# EAGLE design at90USB (EAGLE 5.03)
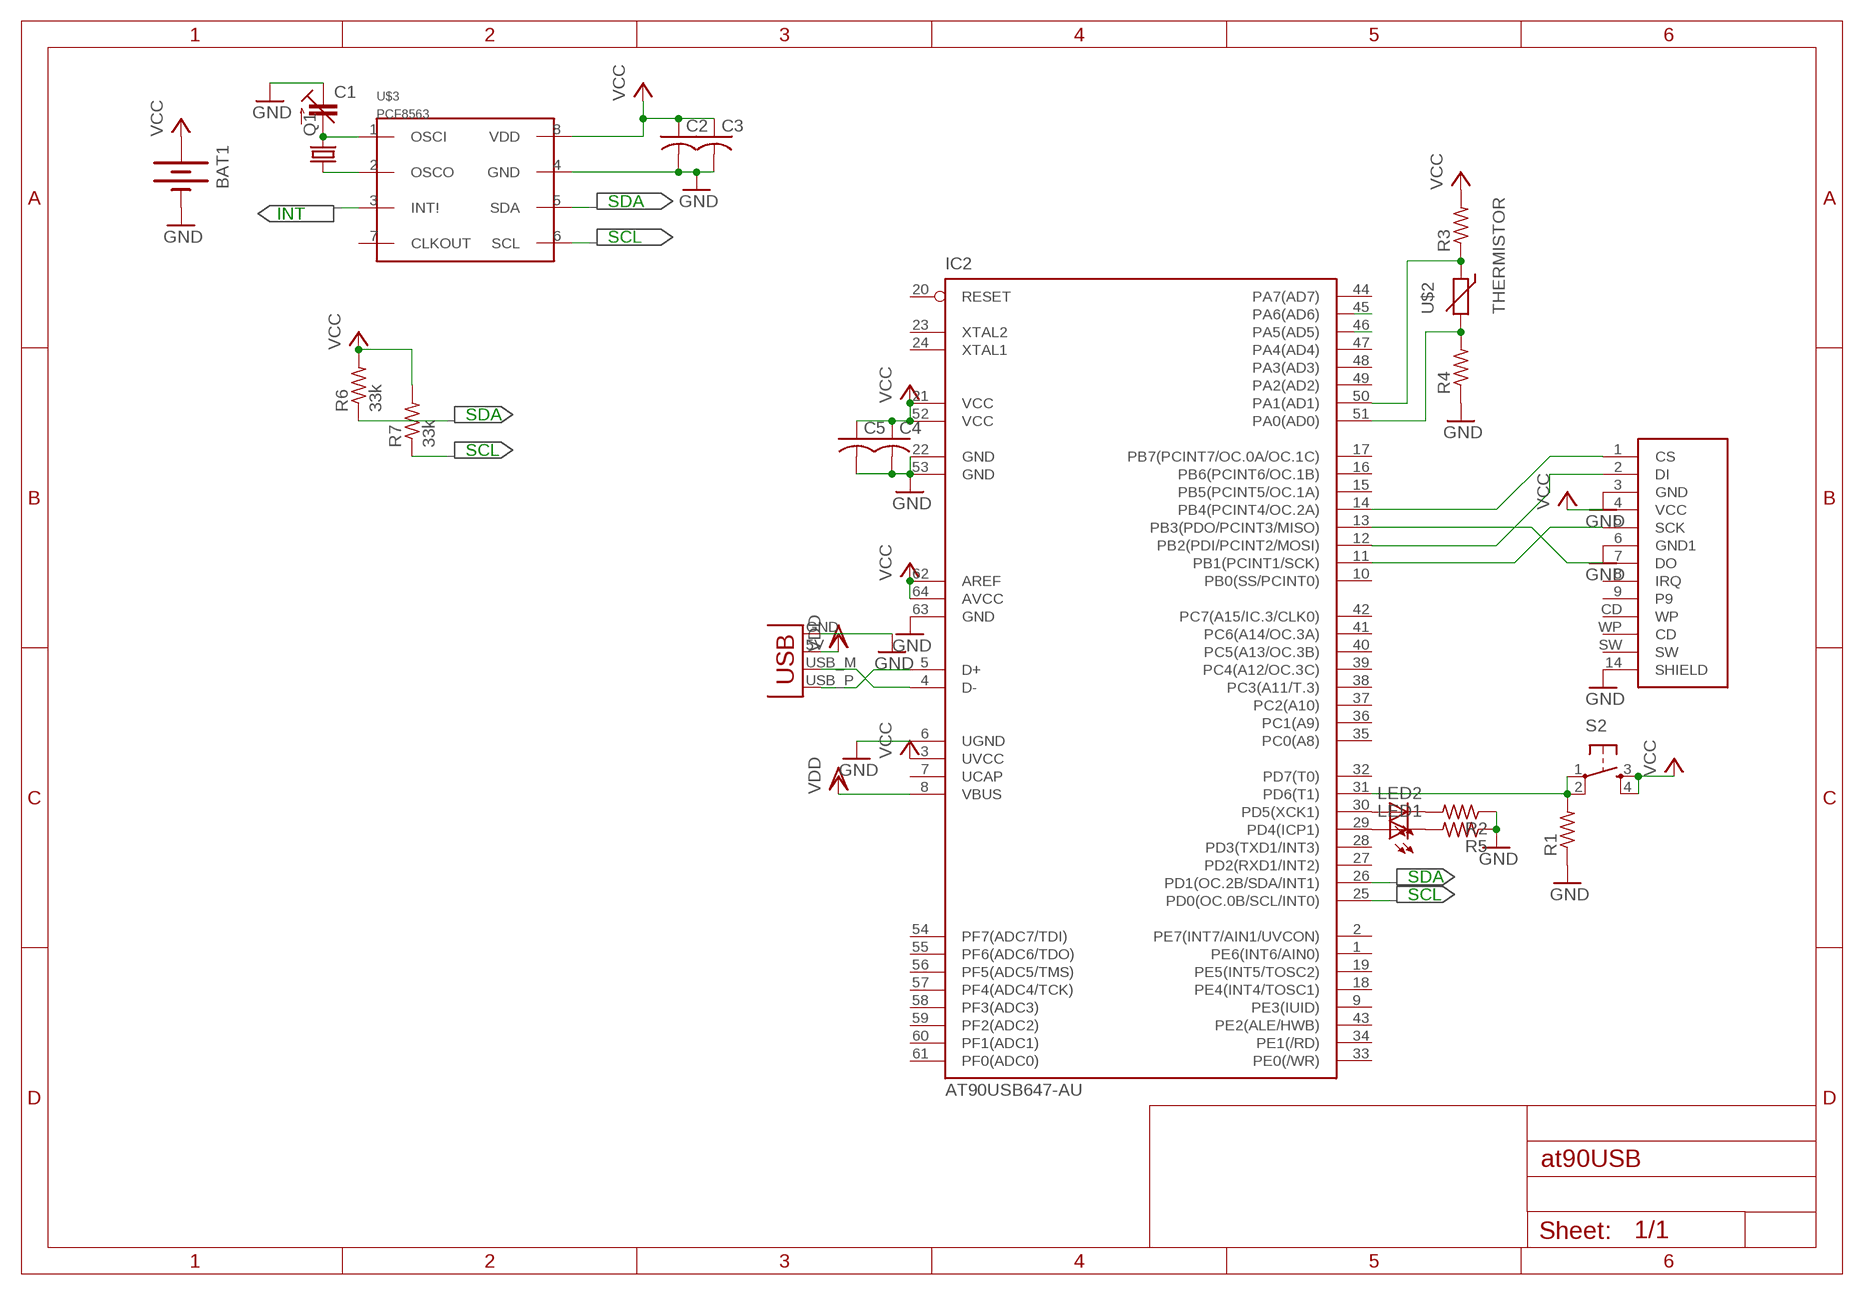
[diagram p0: schematic, sheet 1]

## Parts
BAT1  BATTERY20SMD  [BATTCON_20MM]
C1  C-TRIMM3018_11  [CTRIM3018_11]
C2  C-USC0603  [C0603]
C3  C-USC0603  [C0603]
C4  C-USC0603  [C0603]
C5  C-USC0603  [C0603]
IC2  AT90USB647-AU  [TQFP64]
LED1  LEDCHIP-LED0603  [CHIP-LED0603]
LED2  LEDCHIP-LED0603  [CHIP-LED0603]
Q1  CRYSTAL5X3  [CRYSTAL-SMD-5X3]
R1  R-US_R0603  [R0603]
R2  R-US_R0603  [R0603]
R3  R-US_R0603  [R0603]
R4  R-US_R0603  [R0603]
R5  R-US_R0603  [R0603]
R6  33k  R-US_R0603  [R0603]
R7  33k  R-US_R0603  [R0603]
S2  TAC_SWITCHSMD  [TACTILE_SWITCH_SMD]
U$1  SD_CARD_SOCKETSD  [SD-MMC_SOCKET-PP]
U$2  THERMISTOR  [0603]
U$3  PCF8563  [SO8]
X1  USBPCB  [USB-A-PCB]

## Nets
GND: BAT1.2(-) C1.+(E) C2.2 C3.2 C4.2 C5.2 IC2.6(UGND) IC2.22(GND) IC2.53(GND) IC2.63(GND) R1.1 R2.1 R4.1 R5.1 U$1.3(GND) U$1.6(GND1) U$1.14(SHIELD) U$3.4(GND) X1.GND
N$1: IC2.45(PA6(AD6))
N$2: U$3.3(INT!)
N$3: IC2.51(PA0(AD0)) R4.2 U$2.2
N$4: IC2.5(D+) X1.USB_P(D+)
N$5: IC2.4(D-) X1.USB_M(D-)
N$6: IC2.29(PD4(ICP1)) LED1.A
N$7: IC2.11(PB1(PCINT1/SCK)) U$1.5(SCK)
N$8: IC2.12(PB2(PDI/PCINT2/MOSI)) U$1.2(DI)
N$9: IC2.13(PB3(PDO/PCINT3/MISO)) U$1.7(DO)
N$10: IC2.14(PB4(PCINT4/OC.2A)) U$1.1(CS)
N$11: IC2.30(PD5(XCK1)) LED2.A
N$12: IC2.31(PD6(T1)) R1.2 S2.1 S2.2
N$13: IC2.50(PA1(AD1)) R3.1 U$2.1
N$14: IC2.46(PA5(AD5))
N$15: LED2.C R2.2
N$16: LED1.C R5.2
N$17: C1.-(A) Q1.3 U$3.1(OSCI)
N$18: Q1.1 U$3.2(OSCO)
SCL: IC2.25(PD0(OC.0B/SCL/INT0)) R7.1 U$3.6(SCL)
SDA: IC2.26(PD1(OC.2B/SDA/INT1)) R6.1 U$3.5(SDA)
VCC: BAT1.1(+) C2.1 C3.1 C4.1 C5.1 IC2.3(UVCC) IC2.21(VCC) IC2.52(VCC) IC2.62(AREF) IC2.64(AVCC) R3.2 R6.2 R7.2 S2.3 S2.4 U$1.4(VCC) U$3.8(VDD)
VDD: IC2.8(VBUS) X1.5V(VBUS)
Unconnected: IC2.1(PE6(INT6/AIN0)) IC2.2(PE7(INT7/AIN1/UVCON)) IC2.9(PE3(IUID)) IC2.10(PB0(SS/PCINT0)) IC2.15(PB5(PCINT5/OC.1A)) IC2.16(PB6(PCINT6/OC.1B)) IC2.17(PB7(PCINT7/OC.0A/OC.1C)) IC2.18(PE4(INT4/TOSC1)) IC2.19(PE5(INT5/TOSC2)) IC2.20(RESET) IC2.23(XTAL2) IC2.24(XTAL1) IC2.27(PD2(RXD1/INT2)) IC2.28(PD3(TXD1/INT3)) IC2.32(PD7(T0)) IC2.33(PE0(/WR)) IC2.34(PE1(/RD)) IC2.35(PC0(A8)) IC2.36(PC1(A9)) IC2.37(PC2(A10)) IC2.38(PC3(A11/T.3)) IC2.39(PC4(A12/OC.3C)) IC2.40(PC5(A13/OC.3B)) IC2.41(PC6(A14/OC.3A)) IC2.42(PC7(A15/IC.3/CLK0)) IC2.43(PE2(ALE/HWB)) IC2.44(PA7(AD7)) IC2.47(PA4(AD4)) IC2.48(PA3(AD3)) IC2.49(PA2(AD2)) IC2.54(PF7(ADC7/TDI)) IC2.55(PF6(ADC6/TDO)) IC2.56(PF5(ADC5/TMS)) IC2.57(PF4(ADC4/TCK)) IC2.58(PF3(ADC3)) IC2.59(PF2(ADC2)) IC2.60(PF1(ADC1)) IC2.61(PF0(ADC0)) U$1.8(IRQ) U$1.9 U$1.CD(WP) U$1.SW U$1.WP(CD) U$3.7(CLKOUT)

## Notes on the sheet
- INT | SDA
- SCL
- SDA
- SCL
- SDA
- SCL

## Power pins joined to a net without a drawn wire
UCAP: IC2.7(UCAP)

## Library data of the parts
BAT1 = SparkFun:BATTERY: Battery Holders Various common sizes : AA, AAA, 20mm coin cell and 12mm coin cell.
C1 = rcl:C-TRIMM: Trimm capacitor
C2-C5 = rcl:C-US: CAPACITOR, American symbol
IC2 = at90usb:AT90USB647-*: Atmel AT90USB647 AVR Microcontroller with USB Interface and 64kB Flash Memory
LED1 LED2 = led:LED: LED OSRAM: - CHIPLED LG R971, LG N971, LY N971, LG Q971, LY Q971, LO R971, LY R971 LH N974, LH R974 LS Q976, LO Q976, LY Q976 LO Q996 - Hyper CHIPLED LW Q18S LB Q993, LB Q99A, LB R99A - SideLED LS A670, LO A670, LY A670, LG A670, LP A670 LB A673, LV A673, LT A673, LW A673 LH A674 LY A675 LS A676, LA A676, LO A676, LY A676, LW A676 LS A679, LY A679, LG A679 - Hyper Micro SIDELED® LS Y876, LA Y876, LO Y876, LY Y876 LT Y87S - SmartLED LW L88C, LW L88S LB L89C, LB L89S, LG L890 LS L89K, LO L89K, LY L89K LS L896, LA L896, LO L896, LY L896 - TOPLED LS T670, LO T670, LY T670, LG T670, LP T670 LSG T670, LSP T670, LSY T670, LOP T670, LYG T670 LG T671, LOG T671, LSG T671 LB T673, LV T673, LT T673, LW T673 LH T674 LS T676, LA T676, LO T676, LY T676, LB T676, LH T676, LSB T676, LW T676 LB T67C, LV T67C, LT T67C, LS T67K, LO T67K, LY T67K, LW E67C LS E67B, LA E67B, LO E67B, LY E67B, LB E67C, LV E67C, LT E67C LW T67C LS T679, LY T679, LG T679 LS T770, LO T770, LY T770, LG T770, LP T770 LB T773, LV T773, LT T773, LW T773 LH T774 LS E675, LA E675, LY E675, LS T675 LS T776, LA T776, LO T776, LY T776, LB T776 LHGB T686 LT T68C, LB T68C - Hyper Mini TOPLED® LB M676 - Mini TOPLED Santana® LG M470 LS M47K, LO M47K, LY M47K Source: http://www.osram.convergy.de - LUMILED® LXK2-PW12-R00, LXK2-PW12-S00, LXK2-PW14-U00, LXK2-PW14-V00 LXK2-PM12-R00, LXK2-PM12-S00, LXK2-PM14-U00 LXK2-PE12-Q00, LXK2-PE12-R00, LXK2-PE12-S00, LXK2-PE14-T00, LXK2-PE14-U00 LXK2-PB12-K00, LXK2-PB12-L00, LXK2-PB12-M00, LXK2-PB14-N00, LXK2-PB14-P00, LXK2-PB14-Q00 LXK2-PR12-L00, LXK2-PR12-M00, LXK2-PR14-Q00, LXK2-PR14-R00 LXK2-PD12-Q00, LXK2-PD12-R00, LXK2-PD12-S00 LXK2-PH12-R00, LXK2-PH12-S00 LXK2-PL12-P00, LXK2-PL12-Q00, LXK2-PL12-R00 Source: www.luxeon.com
Q1 = SparkFun:CRYSTAL: Crystals Various standard crystals. Proven footprints. Spark Fun Electronics SKU : COM-00534
R1-R7 = rcl:R-US_: RESISTOR, American symbol
S2 = SparkFun:TAC_SWITCH: Momentary Switch Button commonly used for reset or general input. Spark Fun Electronics SKU : COM-00097
U$1 = SparkFun:SD_CARD_SOCKET: SD/MMC Socket Media socket for SD and MMC cards. Push-push type. Schematic element and footprint production proven. Spark Fun Electronics SKU : PRT-00136
U$2 = nublabs:THERMISTOR
U$3 = nublabs:PCF8563
X1 = SparkFun:USB: USB Connectors USB-B-PTH is fully proven SKU : PRT-00139 USB-miniB is fully proven SKU : PRT-00587 USB-A-PCB is untested. USB-A-H is throughly reviewed, but untested. Spark Fun Electronics SKU : PRT-00437 USB-B-SMT is throughly reviewed, but untested. Needs silkscreen touching up. USB-A-S has not been used/tested USB-MB-H has not been used/tested

## Board
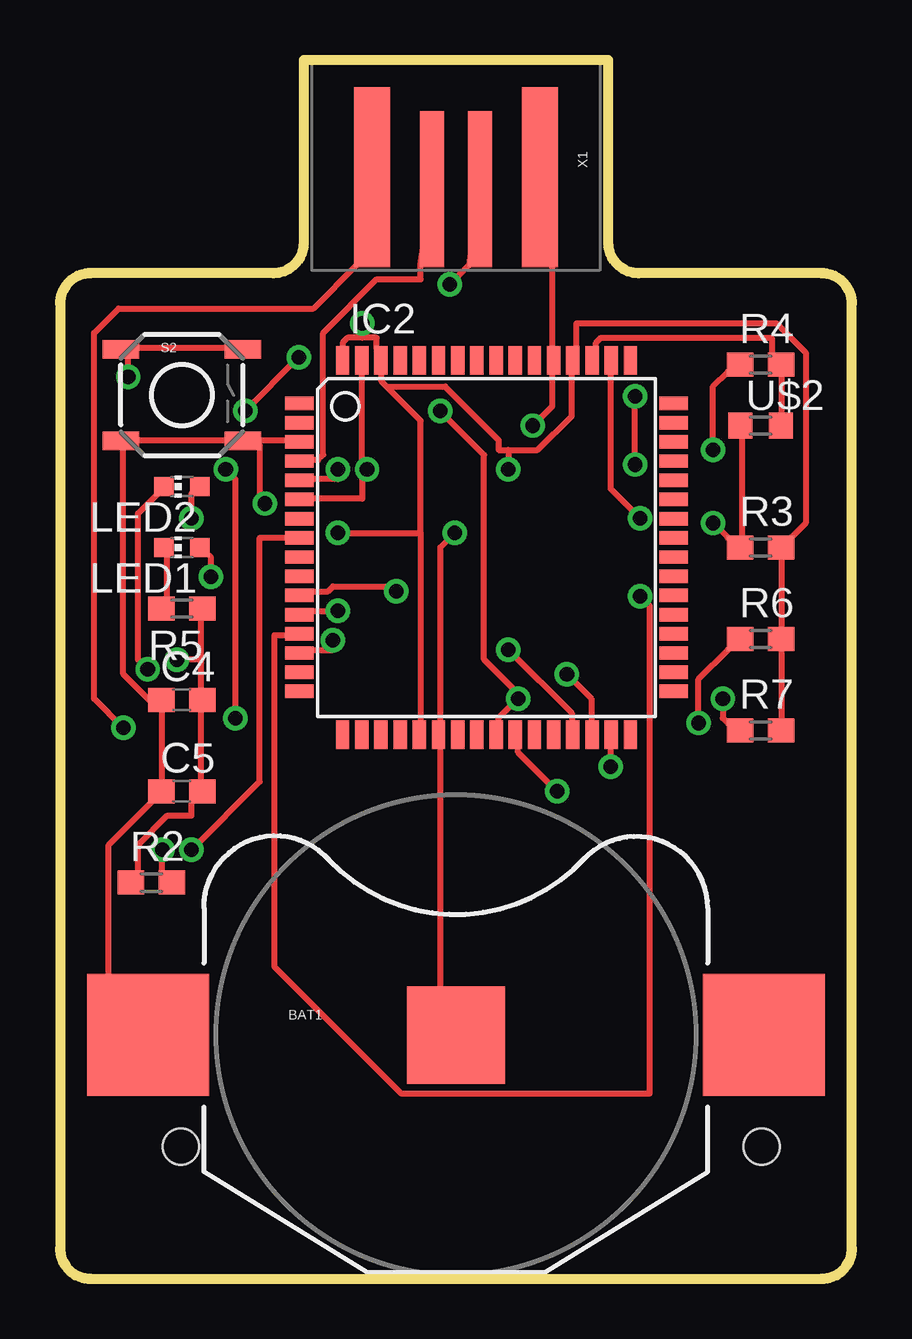
[diagram p1: board, top side]
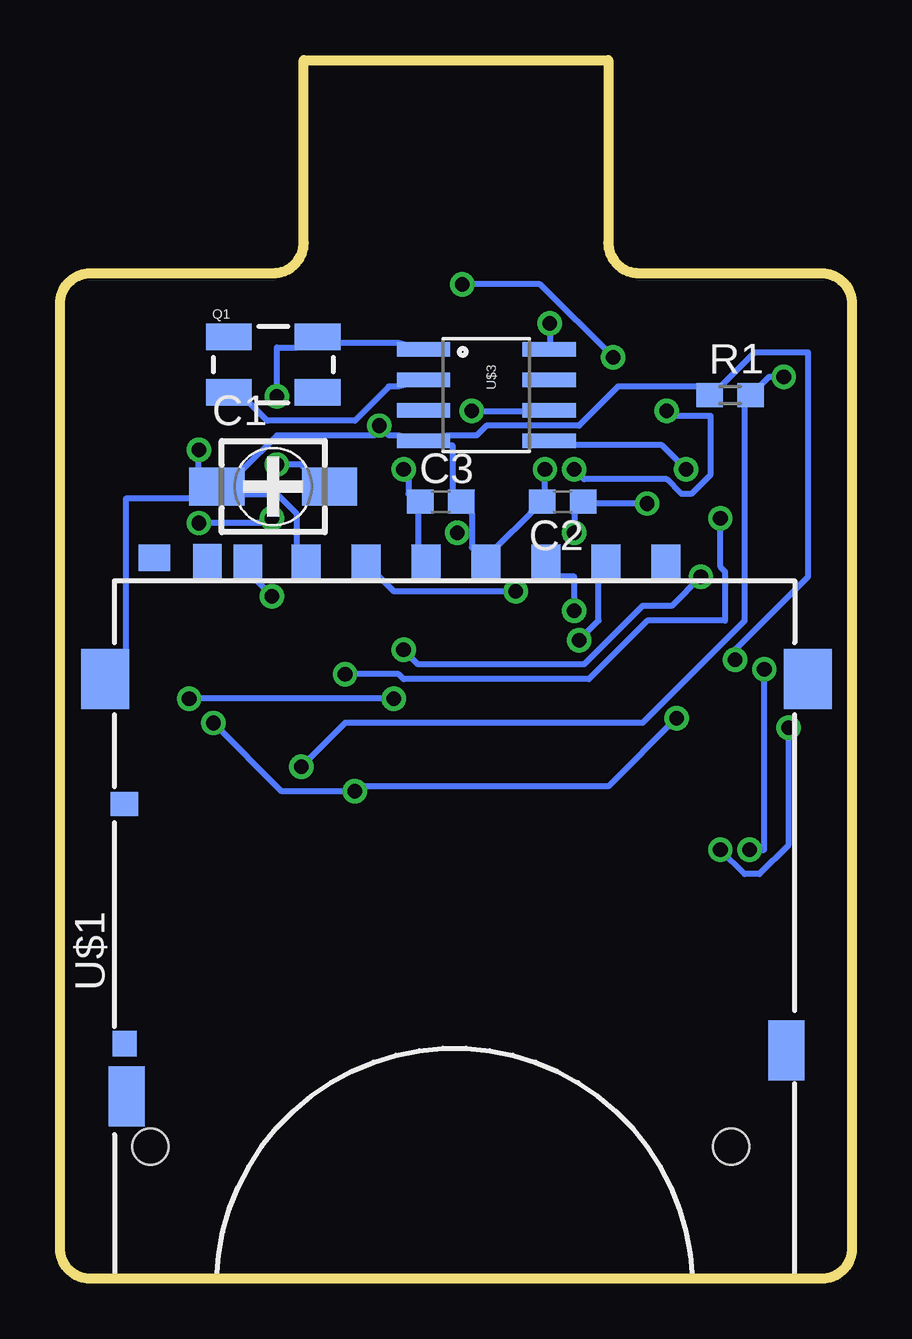
[diagram p2: board, bottom side, seen from below]

Size 33.02 x 50.8 mm. Coordinates in mm from the lower left corner, seen from the top.
Outline: 33.02,40.64 arc90 31.75,41.91 24.13,41.91 arc-90 22.86,43.18 22.86,50.8 10.16,50.8 10.16,43.18 arc-90 8.89,41.91 1.27,41.91 arc90 0,40.64 0,1.27 arc90 1.27,0 31.75,0 arc90 33.02,1.27 33.02,40.64
Copper layers (1*16): Top 0.035mm / dielectric 1.5mm / Bottom 0.035mm
Design rules "default": minimum track width 10mil, minimum drill 24mil, track to track 8mil, track to pad 8mil, pad to pad 8mil, via to via 8mil, smd to smd 8mil, copper to edge 40mil, drill to drill 8mil, minimum pad ring 10mil, minimum via ring 8mil, stop-mask expansion 4mil, vias tented up to drill 0mil, thermal gap 10mil

### Footprints (pad centres in the part's own frame; a part is rotated, then mirrored left to right if it is on the bottom)
BATTCON_20MM = smd 5.08 x 5.08: 1 -12.827,0; 3 12.827,0 | smd 4.064 x 4.064: 2 0,0
CTRIM3018_11 = smd 2.3 x 1.6: + -2.35,0; - 2.35,0
C0603 = smd 1.1 x 1: 1 -0.85,0; 2 0.85,0
TQFP64 = smd 1.194 x 0.559: 1 -7.8,6; 2 -7.8,5.2; 3 -7.8,4.4; 4 -7.8,3.6; 5 -7.8,2.8; 6 -7.8,2; 7 -7.8,1.2; 8 -7.8,0.4; 9 -7.8,-0.4; 10 -7.8,-1.2; 11 -7.8,-2; 12 -7.8,-2.8; 13 -7.8,-3.6; 14 -7.8,-4.4; 15 -7.8,-5.2; 16 -7.8,-6; 33 7.8,-6; 34 7.8,-5.2; 35 7.8,-4.4; 36 7.8,-3.6; 37 7.8,-2.8; 38 7.8,-2; 39 7.8,-1.2; 40 7.8,-0.4; 41 7.8,0.4; 42 7.8,1.2; 43 7.8,2; 44 7.8,2.8; 45 7.8,3.6; 46 7.8,4.4; 47 7.8,5.2; 48 7.8,6 | smd 0.559 x 1.194: 17 -6,-7.8; 18 -5.2,-7.8; 19 -4.4,-7.8; 20 -3.6,-7.8; 21 -2.8,-7.8; 22 -2,-7.8; 23 -1.2,-7.8; 24 -0.4,-7.8; 25 0.4,-7.8; 26 1.2,-7.8; 27 2,-7.8; 28 2.8,-7.8; 29 3.6,-7.8; 30 4.4,-7.8; 31 5.2,-7.8; 32 6,-7.8; 49 6,7.8; 50 5.2,7.8; 51 4.4,7.8; 52 3.6,7.8; 53 2.8,7.8; 54 2,7.8; 55 1.2,7.8; 56 0.4,7.8; 57 -0.4,7.8; 58 -1.2,7.8; 59 -2,7.8; 60 -2.8,7.8; 61 -3.6,7.8; 62 -4.4,7.8; 63 -5.2,7.8; 64 -6,7.8
CHIP-LED0603 = smd 0.8 x 0.8: A 0,-0.75; C 0,0.75
CRYSTAL-SMD-5X3 = smd 1.9 x 1.1: 1 -1.85,-1.15; 2 1.85,-1.15; 3 1.85,1.15; 4 -1.85,1.15
R0603 = smd 1.1 x 1: 1 -0.85,0; 2 0.85,0
TACTILE_SWITCH_SMD = smd 1.524 x 0.762: 1 -2.54,1.905; 2 2.54,1.905; 3 -2.54,-1.905; 4 2.54,-1.905
SD-MMC_SOCKET-PP = smd 1.2 x 1.5: 1 6.88,29.85; 2 4.38,29.85; 3 1.88,29.85; 4 -0.62,29.85; 5 -3.12,29.85; 6 -5.62,29.85; 7 -8.04,29.85; 8 -9.728,29.87; 9 9.38,29.85 | smd 1.5 x 2.5: 12 -13.1,7.6; 13 14.402,9.525 | smd 2 x 2.5: 14 -14,25; 15 15.3,25 | smd 1.15 x 1: CD -13.18,19.8 | smd 1.3 x 1.1: SW -11.938,30.048 | smd 1 x 1.05: WP -13.18,9.8 | hole 1.5: -12.1,5.5; 12.1,5.5
0603 = smd 1 x 1.1: 1 -0.85,1.27; 2 0.85,1.27
SO8 = smd 0.61 x 2.21: 1 -1.905,-2.616; 2 -0.635,-2.616; 3 0.635,-2.616; 4 1.905,-2.616; 5 1.905,2.616; 6 0.635,2.616; 7 -0.635,2.616; 8 -1.905,2.616
USB-A-PCB = smd 7.5 x 1.5: 5V -0.2,-3.5; GND -0.2,3.5 | smd 6.5 x 1: USB_M 0.3,-1; USB_P 0.3,1

### Placement (x,y rotation side)
BAT1  16.51,10.16 0 top
C1  24.13,33.02 0 bottom
C2  12.06,32.38 180 bottom
C3  17.14,32.38 0 bottom
C4  5.08,24.13 0 top
C5  5.08,20.32 0 top
IC2  17.78,30.48 0 top
LED1  5.08,30.48 90 top
LED2  5.08,33.02 90 top
Q1  24.13,38.1 0 bottom
R1  5.08,36.83 0 bottom
R2  3.81,16.51 0 top
R3  29.21,30.48 0 top
R4  29.21,38.1 0 top
R5  5.08,27.94 180 top
R6  29.21,26.67 0 top
R7  29.21,22.86 0 top
S2  5.08,36.83 0 top
U$1  17.14,0 0 bottom
U$2  29.21,34.29 0 top
U$3  15.24,36.83 270 bottom
X1  16.51,45.72 270 top

### Tracks (layer width: path | path; a pad name or v marks a point on that pad's centre or on a via)
GND  (via drill 0.61)
  Top 0.254: v27.23,34.54 27.23,37.19 27.84,37.8 R4.1 | X1.GND 20.52,42.27 20.52,38.81 IC2.53 20.52,37.8 20.52,36.37 v19.71,35.56 | BAT1.2 15.85,11.99 15.85,22.15 IC2.22 15.85,23.16 15.85,30.48 v16.46,31.09 | R2.1 3.25,16.87 3.25,18.09 4.47,19.3 5.49,19.3 5.49,19.91 C5.2 5.89,20.73 5.89,23.77 C4.2 5.89,24.59 5.89,25.81 | 5.89,25.81 5.89,27.64 R5.1 | 12.6,33.73 12.6,37.8 IC2.63 | 12.6,33.73 12.6,32.51 10.57,32.51 IC2.6 | v12.8,33.73 12.6,33.73 | 5.89,25.81 v4.88,25.81
  Bottom 0.254: v27.23,34.54 27.23,33.73 C1.+ | U$1.6 23.16,30.48 23.16,31.9 23.98,32.72 25.4,32.72 C1.+ | U$1.14 30.28,26.21 30.28,32.51 27.43,32.51 C1.+ | 15.85,31.09 15.85,30.48 U$1.3 14.83,30.48 13.41,31.9 C2.2 12.8,32.72 v12.8,33.73 | 15.85,31.09 15.85,31.9 C3.2 16.66,32.72 16.66,34.75 16.87,34.75 U$3.4 | U$3.4 16.87,35.15 15.65,35.15 15.24,35.56 11.38,35.56 9.75,37.19 6.3,37.19 R1.1 5.49,37.19 4.06,38.61 1.83,38.61 1.83,29.26 4.88,26.21 v4.88,25.81 | 15.85,31.09 v16.46,31.09 | U$3.4 18.9,35.15 19.3,35.15 v19.71,35.56 19.91,35.15 23.98,35.15 25.4,33.73 C1.+
N$3
  Top 0.254: U$2.2 30.07,35.97 30.07,37.8 R4.2 29.67,38.41 29.67,39.22 22.55,39.22 22.35,39.01 22.35,38.81 IC2.51
N$4  (via drill 0.61)
  Top 0.254: v11.58,33.73 11.58,33.33 10.57,33.33 IC2.5 | v7.72,36.17 v9.96,38.41 | v16.26,41.45 17.07,42.27 X1.USB_P
  Bottom 0.254: v11.58,33.73 11.18,33.33 7.72,33.33 7.11,32.72 6.71,32.72 5.89,33.53 5.89,35.97 7.52,35.97 v7.72,36.17 | v9.96,38.41 13.01,41.45 v16.26,41.45
N$5
  Top 0.254: IC2.4 10.57,34.14 10.77,34.14 10.97,34.34 10.97,39.42 13.21,41.66 15.04,41.66 15.04,42.27 X1.USB_M
N$6  (via drill 0.61)
  Top 0.254: v6.3,29.26 6.3,30.07 6.1,30.28 LED1.A | v18.69,26.21 21.34,23.57 21.34,23.16 IC2.29
  Bottom 0.254: v6.3,29.26 7.52,28.04 8.74,28.04 11.18,25.6 18.09,25.6 v18.69,26.21
N$7  (via drill 0.61)
  Top 0.254: v14.02,28.65 14.02,28.85 11.38,28.85 11.18,28.65 10.57,28.65 IC2.11
  Bottom 0.254: v14.02,28.65 19.1,28.65 19.71,29.26 U$1.5
N$8  (via drill 0.61)
  Top 0.254: v11.58,27.84 10.57,27.84 IC2.12
  Bottom 0.254: v11.58,27.84 11.58,29.26 12.19,29.26 U$1.2
N$9  (via drill 0.61)
  Top 0.254: v24.18,28.45 24.59,28.04 24.59,7.72 14.22,7.72 8.94,13.01 8.94,26.82 9.55,26.82 IC2.13
  Bottom 0.254: v24.18,28.45 24.99,29.26 U$1.7
N$10  (via drill 0.61)
  Top 0.254: v11.38,26.62 11.38,26.21 10.57,26.21 IC2.14
  Bottom 0.254: v11.38,26.62 10.57,27.43 10.57,29.26 U$1.1
N$11  (via drill 0.61)
  Top 0.254: v5.49,31.7 5.49,32.72 LED2.A | v21.13,25.2 22.15,24.18 22.15,23.16 IC2.30
  Bottom 0.254: v5.49,31.7 5.49,29.67 5.28,29.46 5.28,27.43 8.53,27.43 10.97,24.99 18.69,24.99 18.9,25.2 v21.13,25.2
N$12  (via drill 0.61)
  Top 0.254: v2.85,37.59 2.85,38.41 S2.1 3.25,38.81 6.91,38.81 S2.2 | v22.96,21.34 22.96,22.15 IC2.31
  Bottom 0.254: v2.85,37.59 3.45,37.59 3.86,37.19 R1.2 4.47,36.37 4.47,27.43 8.74,23.16 21.13,23.16 v22.96,21.34
N$13  (via drill 0.61)
  Top 0.254: U$2.1 28.45,35.15 28.45,30.89 R3.1 27.84,30.89 v27.23,31.5 | v24.18,31.7 22.96,32.92 22.96,37.8 IC2.50
  Bottom 0.254: v24.18,31.7 24.38,31.5 v27.23,31.5
N$15  (via drill 0.61)
  Top 0.254: v3.66,25.4 3.25,25.81 3.25,31.9 4.06,32.72 LED2.C | v4.27,17.88 4.27,16.87 R2.2
  Bottom 0.254: v3.66,25.4 3.66,17.88 v4.27,17.88
N$16
  Top 0.254: LED1.C 4.47,30.28 4.47,28.25 R5.2
N$17  (via drill 0.61)
  Top 0.254: v23.98,33.93 v23.98,36.78
  Bottom 0.254: U$3.1 18.9,39.01 21.34,39.01 Q1.3 23.16,38.81 23.98,38.81 v23.98,36.78 | v23.98,33.93 22.96,33.93 22.76,33.73 C1.-
N$18
  Bottom 0.254: Q1.1 25.2,36.58 24.38,35.76 20.73,35.76 19.3,37.19 18.9,37.19 U$3.2
SCL  (via drill 0.61)
  Top 0.254: v27.64,24.18 27.64,23.37 27.84,23.16 R7.1 | IC2.25 18.29,23.16 18.29,23.37 v19.1,24.18 18.9,24.59 17.68,25.81 17.68,34.34 v15.85,36.17
  Bottom 0.254: v19.1,24.18 v27.64,24.18 | v15.85,36.17 13.61,36.17 U$3.6
SDA  (via drill 0.61)
  Top 0.254: v26.62,23.16 26.62,24.99 27.84,26.21 R6.1 | v20.73,20.32 19.1,21.95 19.1,22.15 IC2.26 | v6.91,33.73 7.32,33.33 v7.32,23.37
  Bottom 0.254: v26.62,23.16 23.77,20.32 v20.73,20.32 20.32,20.52 10.16,20.52 v7.32,23.37 | v6.91,33.73 7.92,34.75 11.58,34.75 U$3.5
VCC  (via drill 0.61)
  Top 0.254: R7.2 30.07,23.16 30.07,26.21 R6.2 30.07,27.03 30.07,30.07 R3.2 30.48,30.89 31.09,31.5 31.09,38.61 29.87,39.83 21.54,39.83 21.54,38.81 IC2.52 21.34,37.8 21.34,35.97 19.91,34.54 18.69,34.54 | 12.6,39.22 13.21,39.22 13.21,38.81 IC2.62 13.41,37.8 13.41,37.39 13.61,37.19 | 12.6,39.22 11.99,39.22 11.79,39.01 11.79,38.81 IC2.64 | 15.04,31.09 15.04,35.76 13.61,37.19 | 15.04,31.09 15.04,23.16 IC2.21 | 18.69,34.54 18.29,34.54 18.29,34.95 16.05,37.19 13.61,37.19 | 12.6,39.22 v12.6,39.83 | 18.69,34.54 v18.69,33.73 | v8.53,32.31 8.33,32.51 8.33,34.75 S2.4 | IC2.3 9.55,34.95 8.33,34.95 S2.4 | S2.4 6.91,34.95 3.25,34.95 S2.3 2.64,34.75 2.64,25.2 3.86,23.98 C4.1 4.27,23.77 4.27,20.73 C5.1 3.86,19.91 2.03,18.09 2.03,12.6 BAT1.1 | v11.58,31.09 15.04,31.09
  Bottom 0.254: U$1.4 18.09,30.48 18.09,31.9 C3.1 18.49,32.72 18.49,33.73 v18.69,33.73 | v12.6,39.83 12.6,39.01 U$3.8 | v8.53,32.31 10.77,32.31 C2.1 11.58,31.9 v11.58,31.09
VDD  (via drill 0.61)
  Top 0.254: v5.49,17.88 8.33,20.73 8.33,30.89 9.55,30.89 IC2.8 | v2.64,22.96 1.42,24.18 1.42,39.42 2.44,40.44 10.57,40.44 12.39,42.27 X1.5V
  Bottom 0.254: v5.49,17.88 4.47,16.87 3.86,16.87 2.64,18.09 v2.64,22.96